# Altium project PCB_Project.PrjPcb
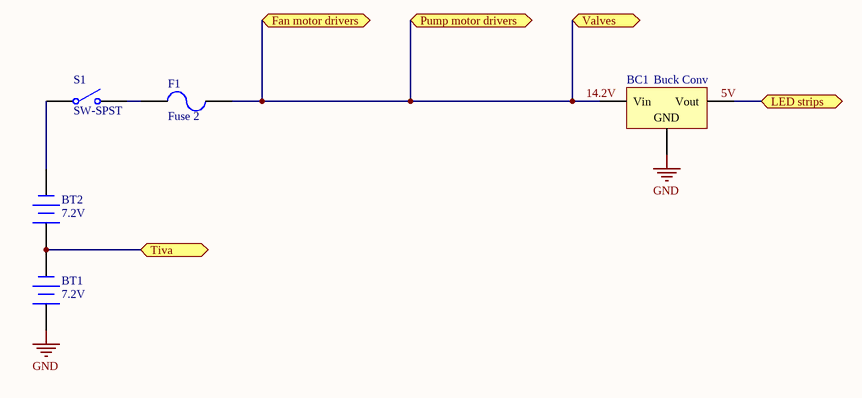
[diagram p0: PowerDistribution.SchDoc]
4 sheets, 29 parts. Net scope: flat (ports and power ports of the same name join across sheets).
Board file: AT long bus (13.3 x 4.2 inches).PCBDOC
Sheets:
  PowerDistribution.SchDoc
  FanPump.SchDoc
  FluidValves.SchDoc
  LEDStrips.SchDoc

## Sheet PowerDistribution.SchDoc
size A

### Parts
BC1  Buck Conv  [D2PAK_L]
BT1  7.2V  [BAT-2]
BT2  7.2V  [BAT-2]
F1  Fuse 2  [PIN-W2/E2.8]
S1  SW-SPST  [SPST-2]

### Ports
Fan motor drivers (bidir), LED strips (bidir), Pump motor drivers (bidir), Tiva (bidir), Valves (bidir)

### Nets
GND: BC1.2(GND) BT1.1(+)
14.2V: BC1.1(Vin) F1.1 ; port Fan motor drivers, port Pump motor drivers, port Valves
NetBC1_3: BC1.3(Vout) ; port LED strips
NetBT1_2: BT1.2(-) BT2.1(+) ; port Tiva
NetBT2_2: BT2.2(-) S1.1(COMMON)
NetF1_2: F1.2 S1.2(NO)

### Notes on the sheet
- Labels drawn without touching a wire or pin: 5V

### Library data of the parts
BC1 = Volt Reg: Voltage Regulator; Published: 24-Mar-1999; LatestRevisionDate: 29-May-2009; LatestRevisionNote: IPC-7351 Footprint Added.; PackageReference: D2PAK; Publisher: Altium Limited; PackageDescription: 3-Pin Transistor Outline Package 2.54 mm Pitch, 15.1 mm Lead Span
BT1 BT2 = Battery: Multicell Battery; Manufacturer: Generic Components; Published: 1999
F1 = Fuse 2: Fuse; Manufacturer: Generic Components; Class: Passive; Published: 08/06/2000; Publisher: Altium Hobart Technology Centre; SubClass: Fuse
S1 = SW-SPST: Single-Pole, Single-Throw Switch; Manufacturer: Generic Components; Published: 1999

## Sheet FanPump.SchDoc
size A
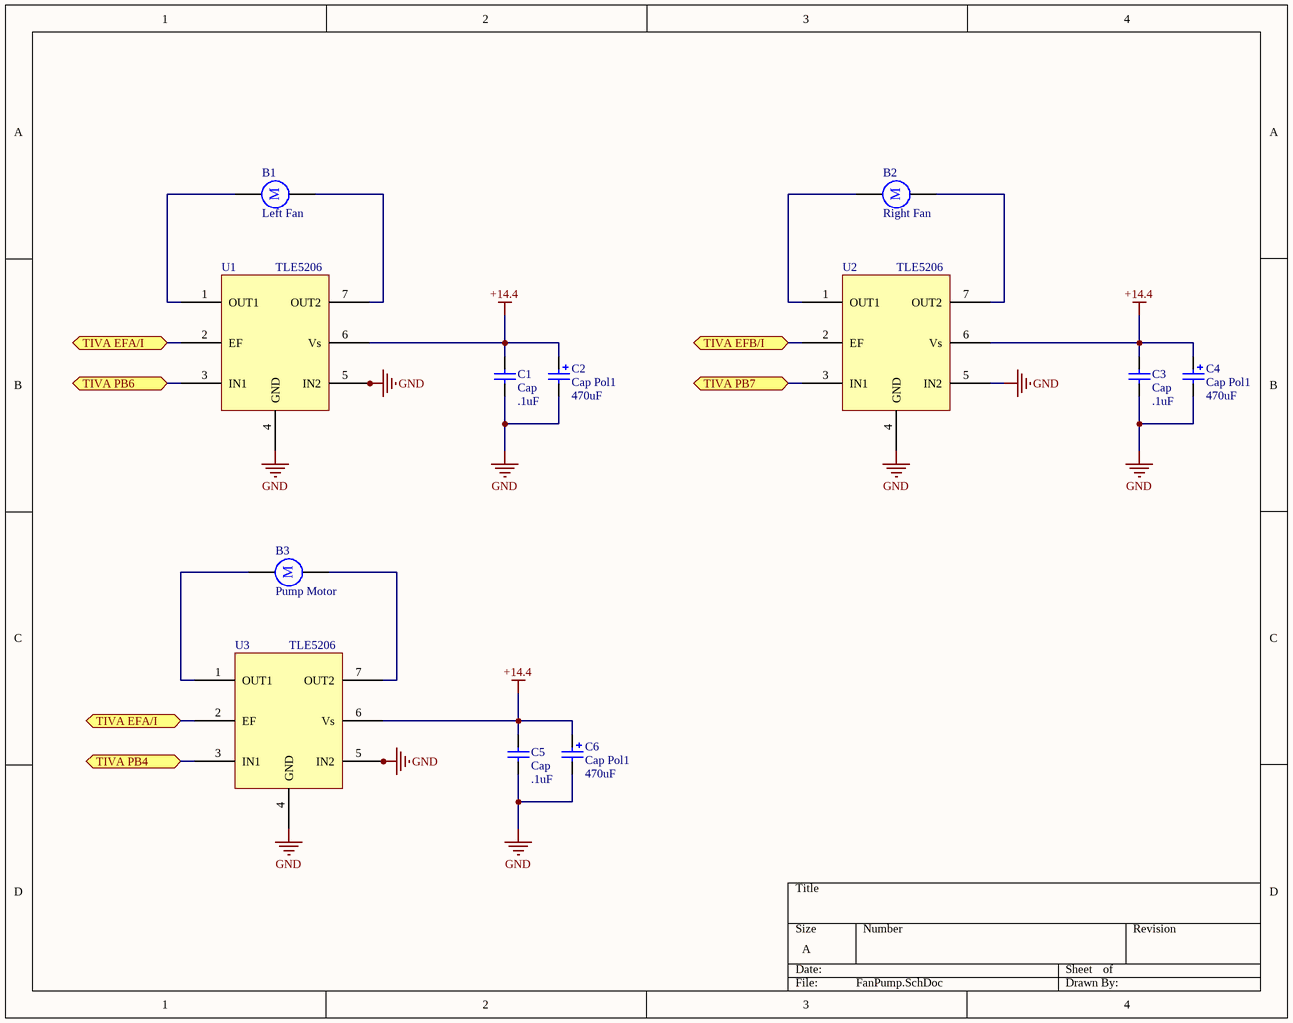
[diagram p1: FanPump.SchDoc]

### Parts
B1  Left Fan  [RB5-10.5]
B2  Right Fan  [RB5-10.5]
B3  Pump Motor  [RB5-10.5]
C1  Cap  value .1uF  [RAD-0.3]
C2  Cap Pol1  value 470uF  [RB7.6-15]
C3  Cap  value .1uF  [RAD-0.3]
C4  Cap Pol1  value 470uF  [RB7.6-15]
C5  Cap  value .1uF  [RAD-0.3]
C6  Cap Pol1  value 470uF  [RB7.6-15]
U1  TLE5206
U2  TLE5206
U3  TLE5206

### Ports
TIVA EFA/I, TIVA EFB/I, TIVA PB4, TIVA PB6, TIVA PB7

### Nets
+14.4: C1.2 C2.1 C3.2 C4.1 C5.2 C6.1 U1.6(Vs) U2.6(Vs) U3.6(Vs)
GND: C1.1 C2.2 C3.1 C4.2 C5.1 C6.2 U1.4(GND) U1.5(IN2) U2.4(GND) U2.5(IN2) U3.4(GND) U3.5(IN2)
NetB1_1: B1.1 U1.1(OUT1)
NetB1_2: B1.2 U1.7(OUT2)
NetB2_1: B2.1 U2.1(OUT1)
NetB2_2: B2.2 U2.7(OUT2)
NetB3_1: B3.1 U3.1(OUT1)
NetB3_2: B3.2 U3.7(OUT2)
NetU1_2: U1.2(EF) U3.2(EF) ; port TIVA EFA/I
NetU1_3: U1.3(IN1) ; port TIVA PB6
NetU2_2: U2.2(EF) ; port TIVA EFB/I
NetU2_3: U2.3(IN1) ; port TIVA PB7
NetU3_3: U3.3(IN1) ; port TIVA PB4

### Notes on the sheet
- (in symbol Motor) M

### Library data of the parts
B1-B3 = Motor: Motor, General Kind; Manufacturer: Generic Components; Published: 1999
C1 C3 C5 = Cap: Capacitor; Manufacturer: Generic Components; Class: Passive; Published: 08/06/2000; Publisher: Altium Hobart Technology Centre; SubClass: Capacitor
C2 C4 C6 = Cap Pol1: Polarized Capacitor (Radial); Manufacturer: Generic Components; Class: Passive; Published: 08/06/2000; Publisher: Altium Hobart Technology Centre; SubClass: Capacitor

## Sheet FluidValves.SchDoc
size A
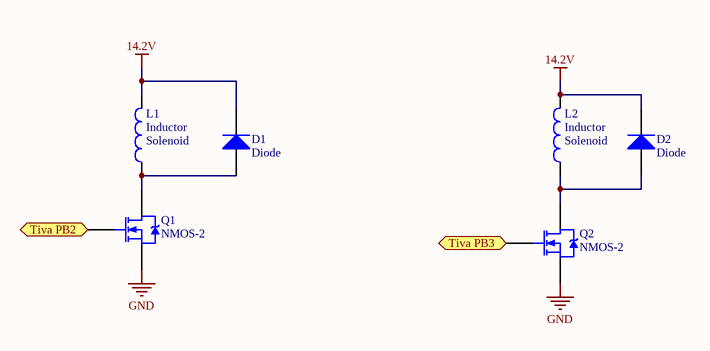
[diagram p2: FluidValves.SchDoc]

### Parts
(Parts that share a designator on the sheet are numbered #1, #2 ... from top to bottom, then left to right.)
D1  Diode  [DSO-C2/X3.3]
D2  Diode  [DSO-C2/X3.3]
L1  Inductor  value Solenoid  [C1005-0402]
L2  Inductor  value Solenoid  [C1005-0402]
Q1#1  NMOS-2  [SFM-T3/A4.7V]
Q2#1  NMOS-2  [SFM-T3/A4.7V]

### Ports
Tiva PB2, Tiva PB3

### Nets
14.2V: D1.2(K) D2.2(K) L1.2 L2.2
GND: Q1#1.3(S) Q2#1.3(S)
NetD1_1: D1.1(A) L1.1 Q1#1.2(D)
NetD2_1: D2.1(A) L2.1 Q2#1.2(D)
NetQ1#1_1: Q1#1.1(G) ; port Tiva PB2
NetQ2#1_1: Q2#1.1(G) ; port Tiva PB3

### Library data of the parts
D1 D2 = Diode: Default Diode; Manufacturer: Generic Components; Class: Discrete; SubClass: Diode - Switching; Published: 08/06/2000; Publisher: Altium Hobart Technology Centre
L1 L2 = Inductor: Manufacturer: Generic Components; Class: Passive; Published: 08/06/2000; Publisher: Altium Hobart Technology Centre; SubClass: Inductor
Q1#1 Q2#1 = NMOS-2: N-Channel Power MOSFET; Manufacturer: Generic Components; Class: Discrete; SubClass: MOSFET - Power; Note: Pin 2 is electrically connected to pin 4.; Published: 08/06/2000

## Sheet LEDStrips.SchDoc
size A
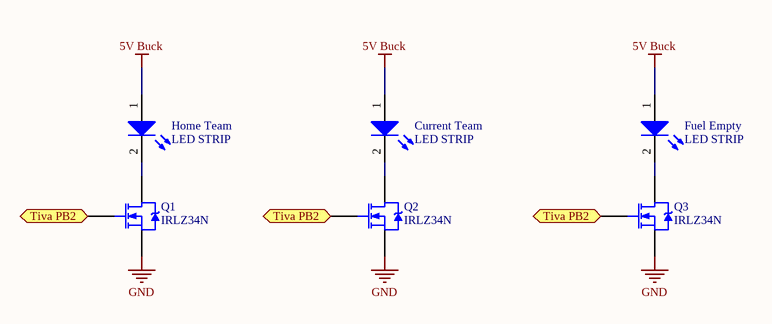
[diagram p3: LEDStrips.SchDoc]

### Parts
(Parts that share a designator on the sheet are numbered #1, #2 ... from top to bottom, then left to right.)
Current_Team  LED STRIP  [LED-0]
Fuel_Empty  LED STRIP  [LED-0]
Home_Team  LED STRIP  [LED-0]
Q1#2  IRLZ34N  [SFM-T3/A4.7V]
Q2#2  IRLZ34N  [SFM-T3/A4.7V]
Q3  IRLZ34N  [SFM-T3/A4.7V]

### Ports
Tiva PB2

### Nets
5V Buck: Current_Team.1(A) Fuel_Empty.1(A) Home_Team.1(A)
GND: Q1#2.3(S) Q2#2.3(S) Q3.3(S)
NetCurrent_Team_2: Current_Team.2(K) Q2#2.2(D)
NetFuel_Empty_2: Fuel_Empty.2(K) Q3.2(D)
NetHome_Team_2: Home_Team.2(K) Q1#2.2(D)
NetQ1#1_1: Q1#2.1(G) Q2#2.1(G) Q3.1(G) ; port Tiva PB2

### Library data of the parts
Current_Team Fuel_Empty Home_Team = LED0: Typical INFRARED GaAs LED; Manufacturer: Generic Components; Class: Optoelectronic; Published: 08/06/2000; Publisher: Altium Hobart Technology Centre; SubClass: LED
Q1#2 Q2#2 Q3 = NMOS-2: as Q1#1 on sheet FluidValves; Published: 08/06/2000

## Nets that join several sheets
GND: PowerDistribution (BC1.2 BT1.1), FanPump (12 pins), FluidValves (Q1#1.3 Q2#1.3), LEDStrips (Q1#2.3 Q2#2.3 Q3.3)
NetQ1#1_1: FluidValves (Q1#1.1), LEDStrips (Q1#2.1 Q2#2.1 Q3.1)